# EAGLE board Johnson (EAGLE 8.5.1)
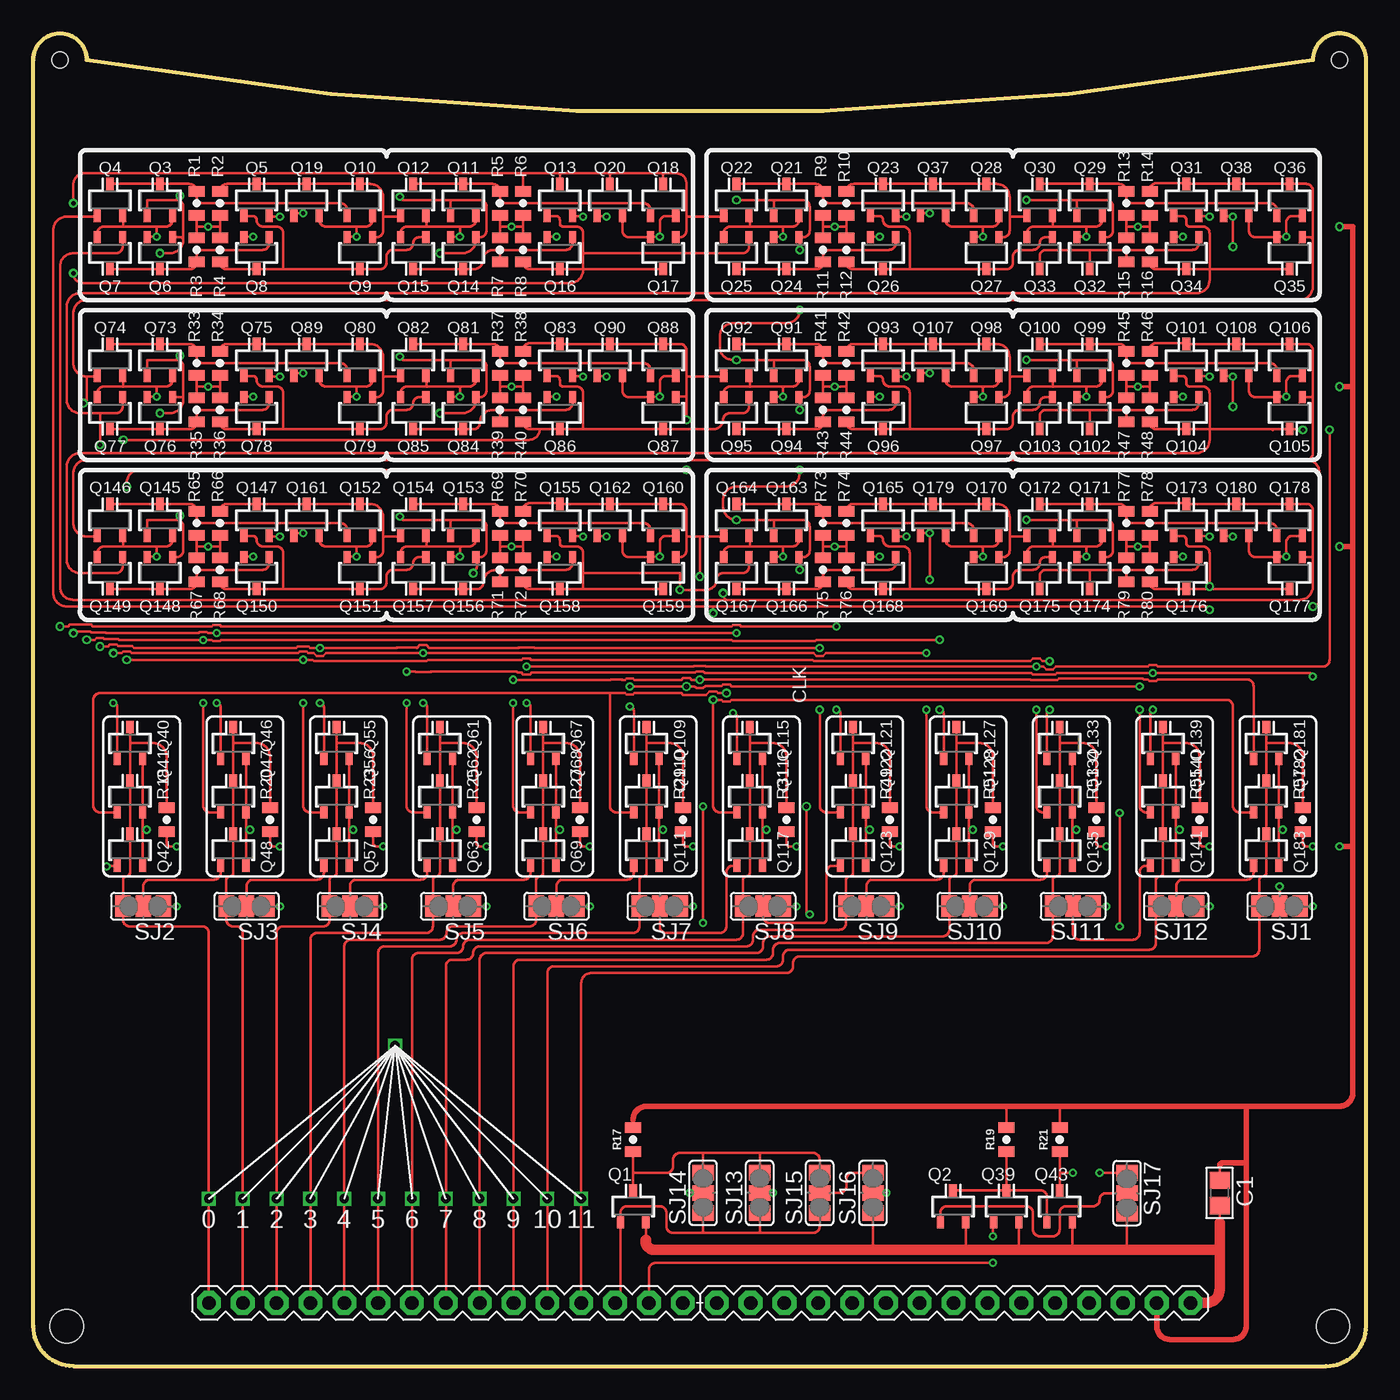
[diagram p5: board, top side]
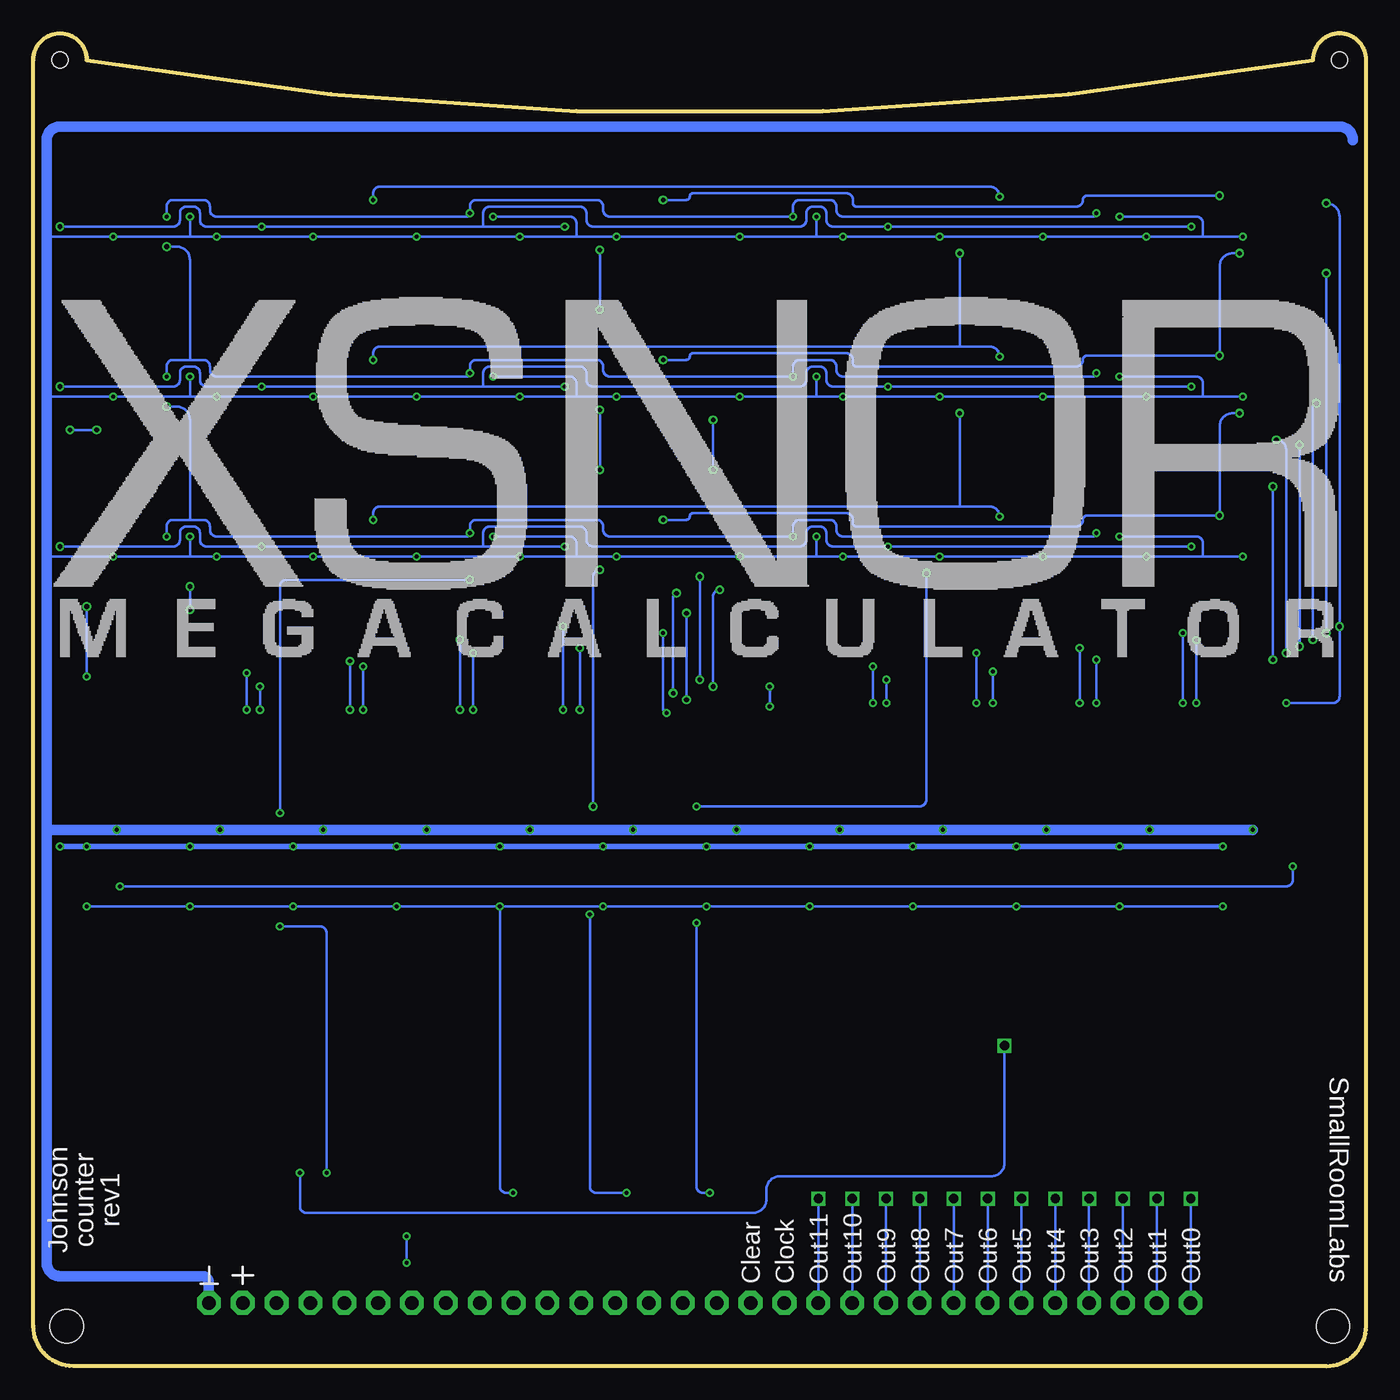
[diagram p6: board, bottom side, seen from below]

Size 100 x 100 mm. Coordinates in mm from the lower left corner, seen from the top.
Outline: 3,0 arc-90 0,3 0,98 arc-90 2,100 arc-90 4,98 arc20 96,98 arc-90 98,100 arc-90 100,98 100,3 arc-90 97,0 3,0
Copper layers (1*16): Top 0.035mm / dielectric 1.5mm / Bottom 0.035mm
Design rules "dirt_cheap_dirty_boards.v1": minimum track width 5mil, minimum drill 12mil, track to track 5mil, track to pad 5mil, pad to pad 5mil, via to via 5mil, smd to smd 0mil, copper to edge 10mil, drill to drill 10mil, minimum pad ring 10mil, minimum via ring 6mil, stop-mask expansion 2mil, vias tented up to drill 25mil, thermal gap 10mil
Net classes: 0 default: width 0.2 mm, drill 0.305 mm, clearance 0.2 mm
Holes 2.5 mm at 2.5,3 97.5,3
Holes 1.2 mm at 2,98 98,98

## Footprints (pad centres in the part's own frame; a part is rotated, then mirrored left to right if it is on the bottom)
C0805 = smd 1.3 x 1.5: 1 -0.95,0; 2 0.95,0
1X30 = drill 1.016 pad 1.778 octagon: 1 -36.83,0; 2 -34.29,0; 3 -31.75,0; 4 -29.21,0; 5 -26.67,0; 6 -24.13,0; 7 -21.59,0; 8 -19.05,0; 9 -16.51,0; 10 -13.97,0; 11 -11.43,0; 12 -8.89,0; 13 -6.35,0; 14 -3.81,0; 15 -1.27,0; 16 1.27,0; 17 3.81,0; 18 6.35,0; 19 8.89,0; 20 11.43,0; 21 13.97,0; 22 16.51,0; 23 19.05,0; 24 21.59,0; 25 24.13,0; 26 26.67,0; 27 29.21,0; 28 31.75,0; 29 34.29,0; 30 36.83,0
SOT23 = smd 0.6 x 0.9: 1 -0.95,-1.2; 2 0.95,-1.2 | smd 0.65 x 0.9: 3 0,1.2
0805 = smd 0.8 x 1.2: 1 -0.9,0; 2 0.9,0
SJ_2 = smd 1.168 x 1.6: 1 -1.524,0; 2 0,0; 3 1.524,0

## Placement (x,y rotation side)
C1  [C0805]  89,13 270 top
JP1  [1X30]  50,4.75 0 top
Q1  310mA/60V/1.6Ω  [SOT23]  45,12 0 top
Q2  310mA/60V/1.6Ω  [SOT23]  69,12 0 top
Q3  310mA/60V/1.6Ω  [SOT23]  9.5,87.5 0 top
Q4  310mA/60V/1.6Ω  [SOT23]  5.75,87.5 0 top
Q5  310mA/60V/1.6Ω  [SOT23]  16.75,87.5 0 top
Q6  310mA/60V/1.6Ω  [SOT23]  9.5,83.5 180 top
Q7  310mA/60V/1.6Ω  [SOT23]  5.75,83.5 180 top
Q8  310mA/60V/1.6Ω  [SOT23]  16.75,83.5 180 top
Q9  310mA/60V/1.6Ω  [SOT23]  24.5,83.5 180 top
Q10  310mA/60V/1.6Ω  [SOT23]  24.5,87.5 0 top
Q11  310mA/60V/1.6Ω  [SOT23]  32.25,87.5 0 top
Q12  310mA/60V/1.6Ω  [SOT23]  28.5,87.5 0 top
Q13  310mA/60V/1.6Ω  [SOT23]  39.5,87.5 0 top
Q14  310mA/60V/1.6Ω  [SOT23]  32.25,83.5 180 top
Q15  310mA/60V/1.6Ω  [SOT23]  28.5,83.5 180 top
Q16  310mA/60V/1.6Ω  [SOT23]  39.5,83.5 180 top
Q17  310mA/60V/1.6Ω  [SOT23]  47.25,83.5 180 top
Q18  310mA/60V/1.6Ω  [SOT23]  47.25,87.5 0 top
Q19  310mA/60V/1.6Ω  [SOT23]  20.5,87.5 0 top
Q20  310mA/60V/1.6Ω  [SOT23]  43.25,87.5 0 top
Q21  310mA/60V/1.6Ω  [SOT23]  56.5,87.5 0 top
Q22  310mA/60V/1.6Ω  [SOT23]  52.75,87.5 0 top
Q23  310mA/60V/1.6Ω  [SOT23]  63.75,87.5 0 top
Q24  310mA/60V/1.6Ω  [SOT23]  56.5,83.5 180 top
Q25  310mA/60V/1.6Ω  [SOT23]  52.75,83.5 180 top
Q26  310mA/60V/1.6Ω  [SOT23]  63.75,83.5 180 top
Q27  310mA/60V/1.6Ω  [SOT23]  71.5,83.5 180 top
Q28  310mA/60V/1.6Ω  [SOT23]  71.5,87.5 0 top
Q29  310mA/60V/1.6Ω  [SOT23]  79.25,87.5 0 top
Q30  310mA/60V/1.6Ω  [SOT23]  75.5,87.5 0 top
Q31  310mA/60V/1.6Ω  [SOT23]  86.5,87.5 0 top
Q32  310mA/60V/1.6Ω  [SOT23]  79.25,83.5 180 top
Q33  310mA/60V/1.6Ω  [SOT23]  75.5,83.5 180 top
Q34  310mA/60V/1.6Ω  [SOT23]  86.5,83.5 180 top
Q35  310mA/60V/1.6Ω  [SOT23]  94.25,83.5 180 top
Q36  310mA/60V/1.6Ω  [SOT23]  94.25,87.5 0 top
Q37  310mA/60V/1.6Ω  [SOT23]  67.5,87.5 0 top
Q38  310mA/60V/1.6Ω  [SOT23]  90.25,87.5 0 top
Q39  310mA/60V/1.6Ω  [SOT23]  73,12 0 top
Q40  310mA/60V/1.6Ω  [SOT23]  7.25,46.75 0 top
Q41  310mA/60V/1.6Ω  [SOT23]  7.25,42.75 0 top
Q42  310mA/60V/1.6Ω  [SOT23]  7.25,38.75 0 top
Q43  310mA/60V/1.6Ω  [SOT23]  77,12 0 top
Q46  310mA/60V/1.6Ω  [SOT23]  15,46.75 0 top
Q47  310mA/60V/1.6Ω  [SOT23]  15,42.75 0 top
Q48  310mA/60V/1.6Ω  [SOT23]  15,38.75 0 top
Q55  310mA/60V/1.6Ω  [SOT23]  22.75,46.75 0 top
Q56  310mA/60V/1.6Ω  [SOT23]  22.75,42.75 0 top
Q57  310mA/60V/1.6Ω  [SOT23]  22.75,38.75 0 top
Q61  310mA/60V/1.6Ω  [SOT23]  30.5,46.75 0 top
Q62  310mA/60V/1.6Ω  [SOT23]  30.5,42.75 0 top
Q63  310mA/60V/1.6Ω  [SOT23]  30.5,38.75 0 top
Q67  310mA/60V/1.6Ω  [SOT23]  38.25,46.75 0 top
Q68  310mA/60V/1.6Ω  [SOT23]  38.25,42.75 0 top
Q69  310mA/60V/1.6Ω  [SOT23]  38.25,38.75 0 top
Q73  310mA/60V/1.6Ω  [SOT23]  9.5,75.5 0 top
Q74  310mA/60V/1.6Ω  [SOT23]  5.75,75.5 0 top
Q75  310mA/60V/1.6Ω  [SOT23]  16.75,75.5 0 top
Q76  310mA/60V/1.6Ω  [SOT23]  9.5,71.5 180 top
Q77  310mA/60V/1.6Ω  [SOT23]  5.75,71.5 180 top
Q78  310mA/60V/1.6Ω  [SOT23]  16.75,71.5 180 top
Q79  310mA/60V/1.6Ω  [SOT23]  24.5,71.5 180 top
Q80  310mA/60V/1.6Ω  [SOT23]  24.5,75.5 0 top
Q81  310mA/60V/1.6Ω  [SOT23]  32.25,75.5 0 top
Q82  310mA/60V/1.6Ω  [SOT23]  28.5,75.5 0 top
Q83  310mA/60V/1.6Ω  [SOT23]  39.5,75.5 0 top
Q84  310mA/60V/1.6Ω  [SOT23]  32.25,71.5 180 top
Q85  310mA/60V/1.6Ω  [SOT23]  28.5,71.5 180 top
Q86  310mA/60V/1.6Ω  [SOT23]  39.5,71.5 180 top
Q87  310mA/60V/1.6Ω  [SOT23]  47.25,71.5 180 top
Q88  310mA/60V/1.6Ω  [SOT23]  47.25,75.5 0 top
Q89  310mA/60V/1.6Ω  [SOT23]  20.5,75.5 0 top
Q90  310mA/60V/1.6Ω  [SOT23]  43.25,75.5 0 top
Q91  310mA/60V/1.6Ω  [SOT23]  56.5,75.5 0 top
Q92  310mA/60V/1.6Ω  [SOT23]  52.75,75.5 0 top
Q93  310mA/60V/1.6Ω  [SOT23]  63.75,75.5 0 top
Q94  310mA/60V/1.6Ω  [SOT23]  56.5,71.5 180 top
Q95  310mA/60V/1.6Ω  [SOT23]  52.75,71.5 180 top
Q96  310mA/60V/1.6Ω  [SOT23]  63.75,71.5 180 top
Q97  310mA/60V/1.6Ω  [SOT23]  71.5,71.5 180 top
Q98  310mA/60V/1.6Ω  [SOT23]  71.5,75.5 0 top
Q99  310mA/60V/1.6Ω  [SOT23]  79.25,75.5 0 top
Q100  310mA/60V/1.6Ω  [SOT23]  75.5,75.5 0 top
Q101  310mA/60V/1.6Ω  [SOT23]  86.5,75.5 0 top
Q102  310mA/60V/1.6Ω  [SOT23]  79.25,71.5 180 top
Q103  310mA/60V/1.6Ω  [SOT23]  75.5,71.5 180 top
Q104  310mA/60V/1.6Ω  [SOT23]  86.5,71.5 180 top
Q105  310mA/60V/1.6Ω  [SOT23]  94.25,71.5 180 top
Q106  310mA/60V/1.6Ω  [SOT23]  94.25,75.5 0 top
Q107  310mA/60V/1.6Ω  [SOT23]  67.5,75.5 0 top
Q108  310mA/60V/1.6Ω  [SOT23]  90.25,75.5 0 top
Q109  310mA/60V/1.6Ω  [SOT23]  46,46.75 0 top
Q110  310mA/60V/1.6Ω  [SOT23]  46,42.75 0 top
Q111  310mA/60V/1.6Ω  [SOT23]  46,38.75 0 top
Q115  310mA/60V/1.6Ω  [SOT23]  53.75,46.75 0 top
Q116  310mA/60V/1.6Ω  [SOT23]  53.75,42.75 0 top
Q117  310mA/60V/1.6Ω  [SOT23]  53.75,38.75 0 top
Q121  310mA/60V/1.6Ω  [SOT23]  61.5,46.75 0 top
Q122  310mA/60V/1.6Ω  [SOT23]  61.5,42.75 0 top
Q123  310mA/60V/1.6Ω  [SOT23]  61.5,38.75 0 top
Q127  310mA/60V/1.6Ω  [SOT23]  69.25,46.75 0 top
Q128  310mA/60V/1.6Ω  [SOT23]  69.25,42.75 0 top
Q129  310mA/60V/1.6Ω  [SOT23]  69.25,38.75 0 top
Q133  310mA/60V/1.6Ω  [SOT23]  77,46.75 0 top
Q134  310mA/60V/1.6Ω  [SOT23]  77,42.75 0 top
Q135  310mA/60V/1.6Ω  [SOT23]  77,38.75 0 top
Q139  310mA/60V/1.6Ω  [SOT23]  84.75,46.75 0 top
Q140  310mA/60V/1.6Ω  [SOT23]  84.75,42.75 0 top
Q141  310mA/60V/1.6Ω  [SOT23]  84.75,38.75 0 top
Q145  310mA/60V/1.6Ω  [SOT23]  9.5,63.5 0 top
Q146  310mA/60V/1.6Ω  [SOT23]  5.75,63.5 0 top
Q147  310mA/60V/1.6Ω  [SOT23]  16.75,63.5 0 top
Q148  310mA/60V/1.6Ω  [SOT23]  9.5,59.5 180 top
Q149  310mA/60V/1.6Ω  [SOT23]  5.75,59.5 180 top
Q150  310mA/60V/1.6Ω  [SOT23]  16.75,59.5 180 top
Q151  310mA/60V/1.6Ω  [SOT23]  24.5,59.5 180 top
Q152  310mA/60V/1.6Ω  [SOT23]  24.5,63.5 0 top
Q153  310mA/60V/1.6Ω  [SOT23]  32.25,63.5 0 top
Q154  310mA/60V/1.6Ω  [SOT23]  28.5,63.5 0 top
Q155  310mA/60V/1.6Ω  [SOT23]  39.5,63.5 0 top
Q156  310mA/60V/1.6Ω  [SOT23]  32.25,59.5 180 top
Q157  310mA/60V/1.6Ω  [SOT23]  28.5,59.5 180 top
Q158  310mA/60V/1.6Ω  [SOT23]  39.5,59.5 180 top
Q159  310mA/60V/1.6Ω  [SOT23]  47.25,59.5 180 top
Q160  310mA/60V/1.6Ω  [SOT23]  47.25,63.5 0 top
Q161  310mA/60V/1.6Ω  [SOT23]  20.5,63.5 0 top
Q162  310mA/60V/1.6Ω  [SOT23]  43.25,63.5 0 top
Q163  310mA/60V/1.6Ω  [SOT23]  56.5,63.5 0 top
Q164  310mA/60V/1.6Ω  [SOT23]  52.75,63.5 0 top
Q165  310mA/60V/1.6Ω  [SOT23]  63.75,63.5 0 top
Q166  310mA/60V/1.6Ω  [SOT23]  56.5,59.5 180 top
Q167  310mA/60V/1.6Ω  [SOT23]  52.75,59.5 180 top
Q168  310mA/60V/1.6Ω  [SOT23]  63.75,59.5 180 top
Q169  310mA/60V/1.6Ω  [SOT23]  71.5,59.5 180 top
Q170  310mA/60V/1.6Ω  [SOT23]  71.5,63.5 0 top
Q171  310mA/60V/1.6Ω  [SOT23]  79.25,63.5 0 top
Q172  310mA/60V/1.6Ω  [SOT23]  75.5,63.5 0 top
Q173  310mA/60V/1.6Ω  [SOT23]  86.5,63.5 0 top
Q174  310mA/60V/1.6Ω  [SOT23]  79.25,59.5 180 top
Q175  310mA/60V/1.6Ω  [SOT23]  75.5,59.5 180 top
Q176  310mA/60V/1.6Ω  [SOT23]  86.5,59.5 180 top
Q177  310mA/60V/1.6Ω  [SOT23]  94.25,59.5 180 top
Q178  310mA/60V/1.6Ω  [SOT23]  94.25,63.5 0 top
Q179  310mA/60V/1.6Ω  [SOT23]  67.5,63.5 0 top
Q180  310mA/60V/1.6Ω  [SOT23]  90.25,63.5 0 top
Q181  310mA/60V/1.6Ω  [SOT23]  92.5,46.75 0 top
Q182  310mA/60V/1.6Ω  [SOT23]  92.5,42.75 0 top
Q183  310mA/60V/1.6Ω  [SOT23]  92.5,38.75 0 top
R1  [0805]  12.25,87.25 270 top
R2  [0805]  14,87.25 270 top
R3  [0805]  12.25,83.75 90 top
R4  [0805]  14,83.75 90 top
R5  [0805]  35,87.25 270 top
R6  [0805]  36.75,87.25 270 top
R7  [0805]  35,83.75 90 top
R8  [0805]  36.75,83.75 90 top
R9  [0805]  59.25,87.25 270 top
R10  [0805]  61,87.25 270 top
R11  [0805]  59.25,83.75 90 top
R12  [0805]  61,83.75 90 top
R13  [0805]  82,87.25 270 top
R14  [0805]  83.75,87.25 270 top
R15  [0805]  82,83.75 90 top
R16  [0805]  83.75,83.75 90 top
R17  [0805]  45,17 90 top
R18  [0805]  10,41 270 top
R19  [0805]  73,17 90 top
R20  [0805]  17.75,41 270 top
R21  [0805]  77,17 90 top
R23  [0805]  25.5,41 270 top
R25  [0805]  33.25,41 270 top
R27  [0805]  41,41 270 top
R29  [0805]  48.75,41 270 top
R31  [0805]  56.5,41 270 top
R33  [0805]  12.25,75.25 270 top
R34  [0805]  14,75.25 270 top
R35  [0805]  12.25,71.75 90 top
R36  [0805]  14,71.75 90 top
R37  [0805]  35,75.25 270 top
R38  [0805]  36.75,75.25 270 top
R39  [0805]  35,71.75 90 top
R40  [0805]  36.75,71.75 90 top
R41  [0805]  59.25,75.25 270 top
R42  [0805]  61,75.25 270 top
R43  [0805]  59.25,71.75 90 top
R44  [0805]  61,71.75 90 top
R45  [0805]  82,75.25 270 top
R46  [0805]  83.75,75.25 270 top
R47  [0805]  82,71.75 90 top
R48  [0805]  83.75,71.75 90 top
R49  [0805]  64.25,41 270 top
R51  [0805]  72,41 270 top
R53  [0805]  79.75,41 270 top
R55  [0805]  87.5,41 270 top
R57  [0805]  95.25,41 270 top
R65  [0805]  12.25,63.25 270 top
R66  [0805]  14,63.25 270 top
R67  [0805]  12.25,59.75 90 top
R68  [0805]  14,59.75 90 top
R69  [0805]  35,63.25 270 top
R70  [0805]  36.75,63.25 270 top
R71  [0805]  35,59.75 90 top
R72  [0805]  36.75,59.75 90 top
R73  [0805]  59.25,63.25 270 top
R74  [0805]  61,63.25 270 top
R75  [0805]  59.25,59.75 90 top
R76  [0805]  61,59.75 90 top
R77  [0805]  82,63.25 270 top
R78  [0805]  83.75,63.25 270 top
R79  [0805]  82,59.75 90 top
R80  [0805]  83.75,59.75 90 top
SJ1  [SJ_2]  93.5,34.5 180 top
SJ2  [SJ_2]  8.25,34.5 180 top
SJ3  [SJ_2]  16,34.5 180 top
SJ4  [SJ_2]  23.75,34.5 180 top
SJ5  [SJ_2]  31.5,34.5 180 top
SJ6  [SJ_2]  39.25,34.5 180 top
SJ7  [SJ_2]  47,34.5 180 top
SJ8  [SJ_2]  54.75,34.5 180 top
SJ9  [SJ_2]  62.5,34.5 180 top
SJ10  [SJ_2]  70.25,34.5 180 top
SJ11  [SJ_2]  78,34.5 180 top
SJ12  [SJ_2]  85.75,34.5 180 top
SJ13  [SJ_2]  54.5,13 90 top
SJ14  [SJ_2]  50.25,13 90 top
SJ15  [SJ_2]  59,13 90 top
SJ16  [SJ_2]  63,13 90 top
SJ17  [SJ_2]  82.05,12.98 270 top

## Tracks (layer width: path | path; a pad name or v marks a point on that pad's centre or on a via)
/CLK  (via drill 0.3, 0.35)
  Top 0.2: 31.3,87.5 Q11.1 | 31.3,87.5 33.5,87.5 arc-90 34,87 34,85.2 arc-90 33.5,84.7 Q14.1 33.2,84.5 arc-90 32.2,83.5 v30.5,83.5 | 78.3,87.5 Q29.1 | 78.3,87.5 v74.5,87.5 | Q32.1 80.5,84.7 arc90 81,85.2 81,87 arc90 80.5,87.5 78.3,87.5 | v27.5,87.75 arc90 27.75,87.5 31.3,87.5 | 31.3,75.5 Q81.1 | 31.3,75.5 33.5,75.5 arc-90 34,75 34,73.2 arc-90 33.5,72.7 Q84.1 33.2,72.5 arc-90 32.2,71.5 v30.5,71.5 | 78.3,75.5 Q99.1 | 78.3,75.5 v74.5,75.5 | Q102.1 80.5,72.7 arc90 81,73.2 81,75 arc90 80.5,75.5 78.3,75.5 | v27.5,75.75 arc90 27.75,75.5 31.3,75.5 | 31.3,63.5 Q153.1 | 31.3,63.5 33.5,63.5 arc-90 34,63 34,61.2 arc-90 33.5,60.7 Q156.1 33.2,60.5 arc-90 32.95,59.5 v33,59.5 | 78.3,63.5 Q171.1 | 78.3,63.5 v74.5,63.5 | Q174.1 80.5,60.7 arc90 81,61.2 81,63 arc90 80.5,63.5 78.3,63.5 | v27.5,63.75 arc90 27.75,63.5 31.3,63.5 | v50.25,42 v50.25,33.25 | v49.25,13 SJ14.2
  Bottom 0.2: v74.5,87.5 74.5,88 arc90 74,88.5 28.25,88.5 arc90 v27.5,87.75 | 30.5,76.5 74,76.5 arc-90 74.5,76 v74.5,75.5 | 30.5,64.5 74,64.5 arc-90 74.5,64 v74.5,63.5 | v30.5,71.5 30.5,64.5 | v30.5,83.5 30.5,76.5 | v27.5,75.75 arc-90 28.25,76.5 30.5,76.5 | v27.5,63.75 arc-90 28.25,64.5 30.5,64.5 | v50.25,33.25 50.25,13.5 arc-90 49.75,13 v49.25,13 | v33,59.5 33,42.5 arc90 33.5,42 v50.25,42
/Q0  (via drill 0.3, 0.35)
  Top 0.2: 41.25,82.3 Q16.3 37.25,82.3 arc-90 36.75,82.8 R8.1 | 41.25,82.3 Q17.3 arc90 47.3,82.25 | 41.25,83.5 41.25,85 arc90 40.75,85.5 39.75,85.5 arc-90 39.5,85.75 39.5,86 arc90 39.2,86.3 Q13.1 | 41.25,83.5 41.25,82.3 | 53.7,84.5 Q25.1 53.7,84 arc-90 53.2,83.5 41.25,83.5 | 41.25,82.3 41.25,82.25 arc-90 40.25,81.25 3.75,81.25 arc-90 v3,82 | v3,55 3.13,55.13 4.26,55.13 4.36,55.03 5.43,55.03 5.45,55 12.4,55 12.5,55.1 13,55.1 13.1,55 v13.75,55 v52.75,55 | Q115.1 52.8,48.7 arc90 v52.5,49 | Q46.1 14.05,49.45 arc90 v13.75,49.75
  Bottom 0.2: v3,82 v3,55 | v52.5,49 52.75,49.25 v52.75,55 | v13.75,49.75 v13.75,55
/Q1  (via drill 0.3, 0.35)
  Top 0.2: 88.25,82.3 Q34.3 84.25,82.3 arc-90 83.75,82.8 R16.1 | 88.25,82.3 Q35.3 arc90 94.3,82.25 | 88.25,82.3 88.25,85 arc90 87.75,85.5 86.75,85.5 arc-90 86.5,85.75 86.5,86 arc90 86.2,86.3 Q31.1 | 6.7,72.5 Q77.1 6.7,72 arc-90 6.2,71.5 5,71.5 | 88.25,82.3 88.25,81.5 arc-90 87.25,80.5 3.5,80.5 arc90 2.5,79.5 2.5,72.5 arc90 3.5,71.5 5,71.5 | 5,71.5 v5,69.13 | v5,54 5.61,54 5.74,54.13 6.26,54.13 6.36,54.03 7.43,54.03 7.56,53.89 19.72,53.89 19.83,54.01 20.67,54.01 20.78,53.9 v21.5,53.9 27.24,53.9 27.25,53.91 28.75,53.91 28.76,53.9 28.8,53.9 29,54.1 29.5,54.1 29.7,53.9 36.41,53.9 36.42,53.91 37.58,53.91 37.59,53.9 v59,53.9 | Q122.1 59.5,41.55 arc-90 59,42.05 v59,49.25 | Q55.1 21.8,49.45 arc90 v21.5,49.75
  Bottom 0.2: v5,69.13 v5,54 | v59,49.25 v59,53.9 | v21.5,49.75 v21.5,53.9
/Q2  (via drill 0.3, 0.35)
  Top 0.2: 41.25,70.3 Q86.3 38,70.3 | Q87.3 41.25,70.3 | 41.25,70.3 41.25,73 arc90 40.75,73.5 39.75,73.5 arc-90 39.5,73.75 39.5,74 arc90 39.2,74.3 Q83.1 | 38,70.3 37.25,70.3 arc-90 36.75,70.8 R40.1 | Q87.3 arc90 47.3,70.25 | 53.7,72.5 Q95.1 53.7,72 arc-90 53.2,71.5 52.25,71.5 arc90 51.75,71 arc-90 51.05,70.3 Q87.3 | 38,70.3 arc-90 37.2,69.5 v6.75,69.5 | v6,53.5 6.61,53.5 6.74,53.63 7.26,53.63 7.4,53.49 19.89,53.49 20,53.6 20.5,53.6 20.61,53.49 21.05,53.49 21.25,53.29 21.75,53.29 21.95,53.49 27.4,53.49 27.42,53.51 28.58,53.51 28.6,53.49 v29.25,53.49 36.57,53.49 36.58,53.51 37.42,53.51 37.43,53.49 58.55,53.49 58.75,53.29 59.25,53.29 59.45,53.49 v67,53.49 | v29.25,49.75 29.25,49.73 arc-90 29.55,49.44 Q61.1 | Q128.1 67.5,41.55 arc-90 67,42.05 v67,49.25
  Bottom 0.2: v6.75,69.5 arc90 6,68.75 v6,53.5 | v67,49.25 v67,53.49 | v29.25,49.75 v29.25,53.49
/Q3  (via drill 0.3, 0.35)
  Top 0.2: 88.25,70.3 Q104.3 84.25,70.3 arc-90 83.75,70.8 R48.1 | Q105.3 93,70.3 | 93,70.3 88.25,70.3 | 88.25,70.3 88.25,73 arc90 87.75,73.5 86.75,73.5 arc-90 86.5,73.75 86.5,74 arc90 86.2,74.3 Q101.1 | Q105.3 arc90 94.3,70.25 | 88.25,70.3 88.25,69.5 arc-90 87.25,68.5 3.5,68.5 arc90 2.5,67.5 2.5,60.5 arc90 3.5,59.5 6.2,59.5 arc90 6.7,60 Q149.1 | 93,70.3 93,70.25 | v95.25,70.25 arc90 95.2,70.3 Q105.3 | v37,52.5 49.55,52.5 49.57,52.53 50.43,52.53 50.46,52.49 v75.25,52.49 75.8,52.49 76,52.29 76.5,52.29 76.7,52.49 83.64,52.49 83.75,52.6 84.25,52.6 84.36,52.49 96.75,52.49 arc90 97.25,52.99 v97.25,70.25 | Q67.1 37.3,49.45 arc90 v37,49.75 | Q134.1 75.75,41.55 arc-90 75.25,42.05 v75.25,49.25
  Bottom 0.2: v95.25,70.25 v97.25,70.25 | v75.25,49.25 v75.25,52.49 | v37,49.75 v37,52.5
/Q4  (via drill 0.3, 0.35)
  Top 0.2: 41.25,58.3 Q158.3 37.25,58.3 arc-90 36.75,58.8 R72.1 | 41.25,58.3 Q159.3 arc90 47.3,58.25 | 41.25,59.5 41.25,61 arc90 40.75,61.5 39.75,61.5 arc-90 39.5,61.75 39.5,62 arc90 39.2,62.3 Q155.1 | 41.25,59.5 41.25,58.3 | 53.7,60.5 Q167.1 53.7,60 arc-90 53.2,59.5 51.75,59.5 arc90 51.25,59 arc-90 50.5,58.25 v48.5,58.25 48.5,59.5 41.25,59.5 | v44.75,51 v49,51 49.61,51 49.74,50.87 50.26,50.87 50.41,51.03 51.64,51.03 51.74,51.13 52.26,51.13 52.39,51 v83,51 | Q109.1 45.05,49.2 arc90 v44.75,49.5 | Q140.1 83.5,41.55 arc-90 83,42.05 v83,49.25
  Bottom 0.2: v49,51 49,57.75 arc90 v48.5,58.25 | v83,49.25 v83,51 | v44.75,49.5 v44.75,51
/Q5  (via drill 0.35)
  Top 0.2: 52.72,41.55 Q116.1 51.5,41.55 arc-90 51,42.05 v51,50 51.61,50 51.74,49.87 52.26,49.87 52.39,50 82.58,50 82.58,49.99 83.42,49.99 83.42,50 89.5,50 arc-90 90,49.5 90,42.05 arc90 90.5,41.55 Q182.1 | 88.25,58.3 Q176.3 84.25,58.3 arc-90 83.75,58.8 R80.1 | 88.25,58.3 Q177.3 arc90 94.3,58.25 | 88.25,58.3 v88.25,58.5 88.25,61 arc90 87.75,61.5 86.75,61.5 arc-90 86.5,61.75 86.5,62 arc90 86.2,62.3 Q173.1 | Q4.1 arc-90 4.75,86.25 2.5,86.25 arc90 1.5,85.25 1.5,58 arc90 2.5,57 51,57 | 51,57 88,57 arc-90 v88.25,56.75 | 51,57 v51,56.5
  Bottom 0.2: v88.25,56.75 arc90 88.25,57 v88.25,58.5 | v51,56.5 v51,50
C0  (via drill 0.3)
  Top 0.2: SJ1.2 v93.5,36 | v5.5,37.5 arc-90 5.55,37.55 Q42.1
  Bottom 0.2: v93.5,36 6,36 arc-90 5.5,36.5 v5.5,37.5
C1
  Top 0.2: SJ2.2 8.25,36 arc-90 8.75,36.5 13.55,36.5 arc90 14.05,37 Q48.1
C2
  Top 0.2: SJ3.2 16,36 arc-90 16.5,36.5 21.3,36.5 arc90 21.8,37 Q57.1
C3
  Top 0.2: SJ4.2 23.75,36 arc-90 24.25,36.5 29.05,36.5 arc90 29.55,37 Q63.1
C4
  Top 0.2: SJ5.2 31.5,36 arc-90 32,36.5 36.8,36.5 arc90 37.3,37 Q69.1
C5
  Top 0.2: SJ6.2 39.25,36 arc-90 39.75,36.5 44.55,36.5 arc90 45.05,37 Q111.1
C6
  Top 0.2: SJ7.2 47,33 arc90 47.5,32.5 51.5,32.5 arc90 52,33 52,37.05 arc-90 52.5,37.55 Q117.1
C7
  Top 0.2: SJ8.2 54.75,33.75 arc90 55.25,33.25 59.25,33.25 arc90 59.5,33.5 59.5,37.05 arc-90 60,37.55 Q123.1
C8
  Top 0.2: SJ9.2 62.5,36 arc-90 63,36.5 67.8,36.5 arc90 68.3,37 Q129.1
C9
  Top 0.2: SJ10.2 70.25,36 arc-90 70.75,36.5 75.55,36.5 arc90 76.05,37 Q135.1
C10
  Top 0.2: Q141.1 83.5,37.55 arc90 83,37.05 83,32.5 arc-90 82.5,32 78.5,32 arc-90 78,32.5 SJ11.2
C11
  Top 0.2: SJ12.2 85.75,36 arc-90 86.25,36.5 91.05,36.5 arc90 91.55,37 Q183.1
CLK  (via drill 0.3, 0.35)
  Top 0.2: Q3.1 8.55,87.5 10.68,87.5 | 10.75,84.7 Q6.1 11.05,84.7 arc-90 11.25,84.5 | 55.55,87.5 Q21.1 | 55.55,87.5 57.75,87.5 arc-90 58.25,87 58.25,85.2 arc-90 57.75,84.7 Q24.1 arc-90 57.5,84.65 v57.5,83.75 | 10.68,87.5 10.75,87.5 arc-90 11.25,87 11.25,85.2 11.25,84.5 | 10.68,87.5 arc90 v11,87.82 | 55.55,87.5 v52.75,87.5 | Q73.1 8.55,75.5 10.68,75.5 | 55.55,75.5 Q91.1 | 55.55,75.5 57.75,75.5 arc-90 58.25,75 58.25,73.2 arc-90 57.75,72.7 Q94.1 arc-90 57.5,72.65 v57.5,71.75 | 10.68,75.5 10.75,75.5 arc-90 11.25,75 11.25,73.2 11.25,72.75 | 10.68,75.5 arc90 v11,75.82 | 55.55,75.5 v52.75,75.5 52.5,75.5 arc-90 51.5,76.5 51.5,77.25 arc-90 52.5,78.25 56.5,78.25 arc90 v57.5,79.25 | Q145.1 8.55,63.5 10.68,63.5 | Q148.1 10.75,60.7 arc90 11.25,61.2 11.25,63 arc90 10.75,63.5 10.68,63.5 | 55.55,63.5 Q163.1 | 55.55,63.5 57.75,63.5 arc-90 58.25,63 58.25,61.2 arc-90 57.75,60.7 Q166.1 arc-90 57.5,60.65 v57.5,59.75 | 10.68,63.5 arc90 v11,63.82 | 55.55,63.5 v52.75,63.5 arc-90 51.75,64.5 51.75,65 arc-90 52.75,66 56.5,66 arc90 57.5,67 v57.5,67.25 | v9.5,71.5 10.25,71.5 arc90 11.25,72.5 11.25,72.75 | Q76.1 11.2,72.7 arc90 11.25,72.75 | v9.5,83.5 10.25,83.5 arc90 11.25,84.5 | v58,42 58,34.14 arc90 v58.25,33.89 | v55.5,13 SJ13.2
  Bottom 0.2: v11,87.82 20.93,87.82 arc-90 21.25,87.5 arc90 21.75,87 38.25,87 arc90 38.5,87.25 38.5,87.5 arc-90 39,88 50.5,88 arc-90 50.75,87.75 arc90 51,87.5 v52.75,87.5 | v52.75,75.5 51,75.5 arc-90 50.75,75.75 arc90 50.5,76 39,76 arc90 38.5,75.5 38.5,75.25 arc-90 38.25,75 21.75,75 arc-90 21.25,75.5 arc90 20.93,75.82 v11,75.82 11,82.5 arc90 10,83.5 v9.5,83.5 | v52.75,63.5 51,63.5 arc-90 50.75,63.75 arc90 50.5,64 39,64 arc90 38.5,63.5 38.5,63.25 arc-90 38.25,63 21.75,63 arc-90 21.25,63.5 arc90 20.93,63.82 v11,63.82 11,70.5 arc90 10,71.5 v9.5,71.5 | v57.5,67.25 v57.5,71.75 | v57.5,79.25 v57.5,83.75 | v58.25,33.89 58.25,13.5 arc-90 57.75,13 v55.5,13 | v58,42 58,59.25 arc90 v57.5,59.75
CLKIN
  Top 0.2: JP1.13 43.9,5 arc45 44.05,5.36 Q1.1 44.05,11.5 arc-90 44.55,12 47,12 arc-90 47.5,11.5 47.5,10.5 arc90 48,10 50.25,10 | SJ15.1 59,10.5 arc-90 58.5,10 55,10 54.5,10 | 54.5,10 51,10 50.25,10 | SJ14.1 50.25,10 | SJ13.1 54.5,10
CLR  (via drill 0.3, 0.35)
  Top 0.2: Q20.1 42.95,86.3 arc-90 v43,86.25 | v20.25,86.5 19.75,86.5 arc90 Q19.1 | Q38.1 89.95,86.3 arc-90 v90,86.25 v90,84 | v67.25,86.5 66.75,86.5 arc90 Q37.1 | Q90.1 42.95,74.3 arc-90 v43,74.25 | v20.25,74.5 19.75,74.5 arc90 Q89.1 | Q108.1 89.95,74.3 arc-90 v90,74.25 v90,72 | v67.25,74.5 66.75,74.5 arc90 Q107.1 | Q162.1 42.95,62.3 arc-90 v43,62.25 | v20.25,62.5 19.75,62.5 arc90 Q161.1 | Q180.1 89.95,62.3 arc-90 v90,62.25 | Q179.1 arc-90 66.75,62.5 v67.25,62.5 v67.25,59 | Q43.3 77,14.5 | 77,14.5 R21.1 | v81.5,41.5 v81.5,33 | v78,14.5 77,14.5
  Bottom 0.2: v20.25,86.5 arc90 20.5,86.25 39.25,86.25 arc90 39.75,86.75 39.75,87 arc-90 40.25,87.5 42.5,87.5 arc-90 43,87 v43,86.25 56.75,86.25 arc90 57.25,86.75 57.25,87 arc-90 57.75,87.5 66.75,87.5 arc-90 67.25,87 v67.25,86.5 arc90 67.5,86.25 86.25,86.25 arc90 86.75,86.75 86.75,87 arc-90 87.25,87.5 89.5,87.5 arc-90 90,87 v90,86.25 | v20.25,74.5 arc90 20.5,74.25 39.25,74.25 arc90 39.75,74.75 39.75,75 arc-90 40.25,75.5 42.5,75.5 arc-90 43,75 v43,74.25 56.75,74.25 arc90 57.25,74.75 57.25,75 arc-90 57.75,75.5 66.75,75.5 arc-90 67.25,75 v67.25,74.5 arc90 67.5,74.25 86.25,74.25 arc90 86.75,74.75 86.75,75 arc-90 87.25,75.5 88.25,75.5 | v90,74.25 90,75 arc90 89.5,75.5 88.25,75.5 | v20.25,62.5 arc90 20.5,62.25 39.25,62.25 arc90 39.75,62.75 39.75,63 arc-90 40.25,63.5 42.5,63.5 arc-90 43,63 v43,62.25 56.75,62.25 arc90 57.25,62.75 57.25,63 arc-90 57.75,63.5 66.75,63.5 arc-90 67.25,63 v67.25,62.5 arc90 67.5,62.25 75.5,62.25 86.25,62.25 arc90 86.75,62.75 86.75,63 arc-90 87.25,63.5 88.25,63.5 | v90,62.25 90,63 arc90 89.5,63.5 88.25,63.5 | 88.25,63.5 88.25,71 arc-90 89.25,72 v90,72 | 88.25,75.5 88.25,83 arc-90 89.25,84 v90,84 | v67.25,59 81,59 arc-90 81.5,58.5 v81.5,41.5 | v81.5,33 78.5,33 arc90 78,32.5 v78,14.5
CLRIN  (via drill 0.3)
  Top 0.2: JP1.14 46.19,7.25 arc-90 46.69,7.75 v72,7.75 | v72,9.75 72,10.75 arc-90 Q39.1
  Bottom 0.2: v72,7.75 v72,9.75
EARLYCLR  (via drill 0.3, 0.7)
  Top 0.2: v80,14.5 arc-90 v80.01,14.51 SJ17.1
  Bottom 0.2: v80,14.5 80,12 arc-90 79.5,11.5 46,11.5 arc-90 45,12.5 45,13.25 arc90 44,14.25 28.13,14.25 arc-90 27.13,15.25 v27.13,24.04
GND  (via drill 0.3)
  Top 0.2: 9.25,85.5 6.75,85.5 | Q4.2 6.75,86.25 6.75,85.5 | 17.75,86.25 Q5.2 arc90 17.75,86.25 | Q6.2 8.6,84.75 v9.25,84.75 9.25,85.5 | Q8.2 15.85,84.75 v16.5,84.75 | Q9.2 23.6,84.75 v24.25,84.75 24.25,85.5 | 32,85.5 29.5,85.5 | 31.25,84.75 Q14.2 31.35,84.75 v32,84.75 32,85.5 | Q12.2 29.5,86.25 29.5,85.5 | 40.5,86.25 Q13.2 41.2,86.3 arc-90 v41.25,86.25 | Q16.2 38.6,84.75 v39.25,84.75 | Q19.2 21.45,86 arc90 21.95,85.5 24.25,85.5 | 24.25,85.5 24.95,85.5 arc90 25.45,86 Q10.2 | 17.75,86.25 v18.5,86.25 | Q7.2 4.8,85 arc-90 5.3,85.5 6.75,85.5 | Q3.2 10.45,86 arc-90 9.95,85.5 9.25,85.5 | Q11.2 33.2,86 arc-90 32.7,85.5 32,85.5 | Q15.2 27.55,85 arc-90 28.05,85.5 29.5,85.5 | Q20.2 44.2,85.2 arc90 44.7,84.7 Q17.2 46.35,84.75 v47,84.75 47,85.8 arc-90 47.5,86.3 Q18.2 | 56.25,85.5 53.75,85.5 | Q22.2 53.75,86.25 53.75,85.5 | 64.75,86.25 Q23.2 arc90 64.75,86.25 | 55.6,84.75 Q24.2 arc-90 55.6,84.75 | Q26.2 62.85,84.75 v63.5,84.75 | Q27.2 70.6,84.75 v71.25,84.75 71.25,85.5 | 79,85.5 76.5,85.5 | 78.25,84.75 Q32.2 78.35,84.75 v79,84.75 79,85.5 | Q30.2 76.5,86.25 76.5,85.5 | 87.5,86.25 Q31.2 88.2,86.3 arc-90 v88.25,86.25 | Q34.2 85.6,84.75 v86.25,84.75 | Q37.2 68.45,86 arc90 68.95,85.5 71.25,85.5 | 71.25,85.5 71.95,85.5 arc90 72.45,86 Q28.2 | 64.75,86.25 v65.5,86.25 | Q25.2 51.8,85 arc-90 52.3,85.5 53.75,85.5 | Q21.2 57.45,86 arc-90 56.95,85.5 56.25,85.5 | Q29.2 80.2,86 arc-90 79.7,85.5 79,85.5 | Q33.2 74.55,85 arc-90 75.05,85.5 76.5,85.5 | Q38.2 91.2,85.2 arc90 91.7,84.7 Q35.2 93.35,84.75 v94,84.75 94,85.8 arc-90 94.5,86.3 Q36.2 | 55.6,84.75 v56.25,84.75 56.25,85.5 | 9.25,73.5 6.75,73.5 | Q74.2 6.75,74.25 6.75,73.5 | 17.75,74.25 Q75.2 arc90 17.75,74.25
  Top 0.2: Q76.2 8.6,72.75 v9.25,72.75 9.25,73.5 | Q78.2 15.85,72.75 v16.5,72.75 | Q79.2 23.6,72.75 v24.25,72.75 24.25,73.5 | 32,73.5 29.5,73.5 | 31.25,72.75 Q84.2 31.35,72.75 v32,72.75 32,73.5 | Q82.2 29.5,74.25 29.5,73.5 | 40.5,74.25 Q83.2 41.2,74.3 arc-90 v41.25,74.25 | Q86.2 38.6,72.75 v39.25,72.75 | Q89.2 21.45,74 arc90 21.95,73.5 24.25,73.5 | 24.25,73.5 24.95,73.5 arc90 25.45,74 Q80.2 | 17.75,74.25 v18.5,74.25 | Q77.2 4.8,73 arc-90 5.3,73.5 6.75,73.5 | Q73.2 10.45,74 arc-90 9.95,73.5 9.25,73.5 | Q81.2 33.2,74 arc-90 32.7,73.5 32,73.5 | Q85.2 27.55,73 arc-90 28.05,73.5 29.5,73.5 | Q90.2 44.2,73.2 arc90 44.7,72.7 Q87.2 46.35,72.75 v47,72.75 47,73.8 arc-90 47.5,74.3 Q88.2 | 56.25,73.5 53.75,73.5 | Q92.2 53.75,74.25 53.75,73.5 | 64.75,74.25 Q93.2 arc90 64.75,74.25 | 55.6,72.75 Q94.2 arc-90 55.6,72.75 | Q96.2 62.85,72.75 v63.5,72.75 | Q97.2 70.6,72.75 v71.25,72.75 71.25,73.5 | 79,73.5 76.5,73.5 | 78.25,72.75 Q102.2 78.35,72.75 v79,72.75 79,73.5 | Q100.2 76.5,74.25 76.5,73.5 | 87.5,74.25 Q101.2 88.2,74.3 arc-90 v88.25,74.25 | Q104.2 85.6,72.75 v86.25,72.75 | Q107.2 68.45,74 arc90 68.95,73.5 71.25,73.5 | 71.25,73.5 71.95,73.5 arc90 72.45,74 Q98.2 | 64.75,74.25 v65.5,74.25 | Q95.2 51.8,73 arc-90 52.3,73.5 53.75,73.5 | Q91.2 57.45,74 arc-90 56.95,73.5 56.25,73.5 | Q99.2 80.2,74 arc-90 79.7,73.5 79,73.5 | Q103.2 74.55,73 arc-90 75.05,73.5 76.5,73.5 | Q108.2 91.2,73.2 arc90 91.7,72.7 Q105.2 93.35,72.75 v94,72.75 94,73.8 arc-90 94.5,74.3 Q106.2 | 55.6,72.75 v56.25,72.75 56.25,73.5 | 9.25,61.5 6.75,61.5 | Q146.2 6.75,62.25 6.75,61.5 | 17.75,62.25 Q147.2 arc90 17.75,62.25 | Q148.2 8.6,60.75 v9.25,60.75 9.25,61.5
  Top 0.2: Q150.2 15.85,60.75 v16.5,60.75 | Q151.2 23.6,60.75 v24.25,60.75 24.25,61.5 | 32,61.5 29.5,61.5 | 31.25,60.75 Q156.2 31.35,60.75 v32,60.75 32,61.5 | Q154.2 29.5,62.25 29.5,61.5 | 40.5,62.25 Q155.2 41.2,62.3 arc-90 v41.25,62.25 | Q158.2 38.6,60.75 v39.25,60.75 | Q161.2 21.45,62 arc90 21.95,61.5 24.25,61.5 | 24.25,61.5 24.95,61.5 arc90 25.45,62 Q152.2 | 17.75,62.25 v18.5,62.25 | Q149.2 4.8,61 arc-90 5.3,61.5 6.75,61.5 | Q145.2 10.45,62 arc-90 9.95,61.5 9.25,61.5 | Q153.2 33.2,62 arc-90 32.7,61.5 32,61.5 | Q157.2 27.55,61 arc-90 28.05,61.5 29.5,61.5 | Q162.2 44.2,61.2 arc90 44.7,60.7 Q159.2 46.35,60.75 v47,60.75 47,61.8 arc-90 47.5,62.3 Q160.2 | 56.25,61.5 53.75,61.5 | Q164.2 53.75,62.25 53.75,61.5 | 64.75,62.25 Q165.2 arc90 64.75,62.25 | 55.6,60.75 Q166.2 arc-90 55.6,60.75 | Q168.2 62.85,60.75 v63.5,60.75 | Q169.2 70.6,60.75 v71.25,60.75 71.25,61.5 | 79,61.5 76.5,61.5 | 78.25,60.75 Q174.2 78.35,60.75 v79,60.75 79,61.5 | Q172.2 76.5,62.25 76.5,61.5 | 87.5,62.25 Q173.2 88.2,62.3 arc-90 v88.25,62.25 | Q176.2 85.6,60.75 v86.25,60.75 | Q179.2 68.45,62 arc90 68.95,61.5 71.25,61.5 | 71.25,61.5 71.95,61.5 arc90 72.45,62 Q170.2 | 64.75,62.25 v65.5,62.25 | Q167.2 51.8,61 arc-90 52.3,61.5 53.75,61.5 | Q163.2 57.45,62 arc-90 56.95,61.5 56.25,61.5 | Q171.2 80.2,62 arc-90 79.7,61.5 79,61.5 | Q175.2 74.55,61 arc-90 75.05,61.5 76.5,61.5 | Q180.2 91.2,61.2 arc90 91.7,60.7 Q177.2 93.35,60.75 v94,60.75 94,61.8 arc-90 94.5,62.3 Q178.2 | 55.6,60.75 v56.25,60.75 56.25,61.5 | Q40.2 Q41.2 8.2,40.25 | 8.2,40.25 Q42.2 | v8.5,40.25 8.2,40.25 | Q46.2 Q47.2 15.95,40.25 | 15.95,40.25 Q48.2 | v16.25,40.25 15.95,40.25 | Q55.2 Q56.2 23.7,40.25
  Top 0.2: 23.7,40.25 Q57.2 | v24,40.25 23.7,40.25 | Q61.2 Q62.2 31.45,40.25 | 31.45,40.25 Q63.2 | v31.75,40.25 31.45,40.25 | Q67.2 Q68.2 39.2,40.25 | 39.2,40.25 Q69.2 | v39.5,40.25 39.2,40.25 | Q109.2 Q110.2 46.95,40.25 | 46.95,40.25 Q111.2 | v47.25,40.25 46.95,40.25 | Q115.2 Q116.2 54.7,40.25 | 54.7,40.25 Q117.2 | v55,40.25 54.7,40.25 | Q121.2 Q122.2 62.45,40.25 | 62.45,40.25 Q123.2 | v62.75,40.25 62.45,40.25 | Q127.2 Q128.2 70.2,40.25 | 70.2,40.25 Q129.2 | v70.5,40.25 70.2,40.25 | Q133.2 Q134.2 77.95,40.25 | 77.95,40.25 Q135.2 | v78.25,40.25 77.95,40.25 | Q139.2 Q140.2 85.7,40.25 | 85.7,40.25 Q141.2 | v86,40.25 85.7,40.25 | Q181.2 Q182.2 93.45,40.25 | 93.45,40.25 Q183.2 | v93.75,40.25 93.45,40.25 | Q1.2 45.95,9.5 | SJ17.3 82.05,9.05 arc-90 82,8.75 | Q43.2 77.95,9.05 arc90 78,8.75 | Q2.2 69.95,9.05 arc90 70,8.75 | Q39.2 73.95,9.05 arc90 74,8.75 | SJ16.1 63,8.75 | 89,10.75 C1.2
  Top 0.8: 45.95,9.5 arc90 46.45,8.75 63,8.75 70,8.75 74,8.75 78,8.75 82,8.75 89,8.75 | JP1.30 88,4.75 arc90 89,5.75 89,8.75 | 89,8.75 89,10.75
  Bottom 0.2: 12.25,84.75 v16.5,84.75 v24.25,84.75 v32,84.75 v39.25,84.75 41.25,84.75 | 12.25,84.75 v9.25,84.75 | v18.5,86.25 12.75,86.25 arc90 12.25,85.75 12.25,84.75 | v88.25,86.25 88.25,84.75 | v65.5,86.25 59.75,86.25 arc90 59.25,85.75 59.25,84.75 | v86.25,84.75 v79,84.75 v71.25,84.75 v63.5,84.75 59.25,84.75 | 59.25,84.75 v56.25,84.75 v47,84.75 41.25,84.75 | v41.25,86.25 41.25,84.75 | 12.25,72.75 v16.5,72.75 v24.25,72.75 v32,72.75 v39.25,72.75 41.25,72.75 | 12.25,72.75 v9.25,72.75 | v18.5,74.25 12.75,74.25 arc90 12.25,73.75 12.25,72.75 | v88.25,74.25 88.25,72.75 | v65.5,74.25 59.75,74.25 arc90 59.25,73.75 59.25,72.75 | v86.25,72.75 v79,72.75 v71.25,72.75 v63.5,72.75 59.25,72.75 | 59.25,72.75 v56.25,72.75 v47,72.75 41.25,72.75 | v41.25,74.25 41.25,72.75 | 12.25,60.75 v16.5,60.75 v24.25,60.75 v32,60.75 v39.25,60.75 41.25,60.75 | 12.25,60.75 v9.25,60.75 | v18.5,62.25 12.75,62.25 arc90 12.25,61.75 12.25,60.75 | v88.25,62.25 88.25,60.75 | v65.5,62.25 59.75,62.25 arc90 59.25,61.75 59.25,60.75 | v86.25,60.75 v79,60.75 v71.25,60.75 v63.5,60.75 59.25,60.75 | 59.25,60.75 v56.25,60.75 v47,60.75 41.25,60.75 | v41.25,62.25 41.25,60.75 | v94,84.75 99,84.75 | v94,72.75 99,72.75 | v94,60.75 99,60.75
  Bottom 0.203: v86.25,84.75 88.25,84.75 v94,84.75 | v86.25,72.75 88.25,72.75 v94,72.75 | v86.25,60.75 88.25,60.75 v94,60.75
  Bottom 0.8: 99,40.25 99,7.75 arc-90 98,6.75 87.33,6.75 arc90 86.83,6.25 JP1.30 | 99,40.25 99,60.75 99,72.75 99,84.75 99,92 arc90 98,93 2,93 arc90 1,92 | 99,40.25 v93.75,40.25 v86,40.25 v78.25,40.25 v70.5,40.25 v62.75,40.25 v55,40.25 v47.25,40.25 v39.5,40.25 v31.75,40.25 v24,40.25 v16.25,40.25 v8.5,40.25
N$1  (via drill 0.3)
  Top 0.2: SJ2.1 v10.75,34.5 | v18.5,34.5 SJ3.1 | v26.25,34.5 SJ4.1 | v34,34.5 SJ5.1 | v41.75,34.5 SJ6.1 | v49.5,34.5 SJ7.1 | v57.25,34.5 SJ8.1 | v65,34.5 SJ9.1 | v72.75,34.5 SJ10.1 | v80.5,34.5 SJ11.1 | v88.25,34.5 SJ12.1 | v96,34.5 SJ1.1 | SJ16.2 v64,13
  Bottom 0.2: v10.75,34.5 v18.5,34.5 v26.25,34.5 v34,34.5 v41.75,34.5 v49.5,34.5 v57.25,34.5 64.75,34.5 | 64.75,34.5 v65,34.5 | v65,34.5 v72.75,34.5 v80.5,34.5 v88.25,34.5 v96,34.5 | 65,34.25 arc90 64.75,34.5 | v64,13 64.5,13 arc90 65,13.5 v65,34.5
N$2
  Top 0.2: Q4.3 Q3.3 11.7,88.7 arc-90 R1.1 12.25,87.75 arc90 12.75,87.25 23.05,87.25 arc-90 23.55,86.75 Q10.1
N$3
  Top 0.2: SJ15.2 60.5,13 arc90 61,13.5 61,14.02 arc-90 61.5,14.52 SJ16.3
N$4
  Top 0.2: Q7.3 Q6.3 11.75,82.3 arc90 12.25,82.8 R3.1 12.25,83.25 arc-90 12.75,83.75 17.2,83.75 arc90 17.7,84.25 Q8.1
N$5
  Top 0.2: Q1.3 45,14.5 | 45,14.5 R17.1 | SJ15.3 59,15.5 arc90 58.5,16 55,16 54.5,16 | 45,14.5 47.5,14.5 arc90 48,15 48,15.5 arc-90 48.5,16 50.25,16 | 54.5,16 51,16 50.25,16 | SJ13.3 54.5,16 | SJ14.3 50.25,16
N$6
  Top 0.2: Q39.3 Q2.3 | Q43.1 76.05,12.7 arc90 75.55,13.2 Q39.3 | Q39.3 R19.1
N$7
  Top 0.2: Q12.3 Q11.3 34.45,88.7 arc-90 R5.1 35,87.75 arc90 35.5,87.25 45.8,87.25 arc-90 46.3,86.75 Q18.1
N$8
  Top 0.2: Q16.1 40.45,84.25 arc-90 39.95,83.75 35,83.75 | 35,83.75 34.5,83.75 arc90 33.75,83 arc-90 33.05,82.3 32.5,82.3 | 32.5,82.3 Q14.3 | 32.5,82.3 Q15.3 | 35,83.75 R7.1
N$9
  Top 0.2: R2.1 arc-90 14.55,88.7 Q5.3 Q19.3 Q10.3 25.25,88.7 arc-90 26.25,87.7 26.25,86.25 | Q9.1 25.75,84.7 arc90 26.25,85.2 26.25,86.25 | Q12.1 arc-90 27.5,86.25 26.25,86.25
N$10
  Top 0.2: 18.75,82.3 Q9.3 26,82.3 arc90 26.5,82.8 26.5,83.25 arc-90 27,83.75 28,83.75 arc90 28.5,84.25 arc-90 28.95,84.7 Q15.1 | 18.75,82.3 Q8.3 14.5,82.3 arc-90 14,82.8 R4.1 | Q5.1 16.45,86.3 arc-90 16.75,86 arc90 17.25,85.5 18.25,85.5 arc-90 18.75,85 18.75,82.3
N$11
  Top 0.2: Q22.3 Q21.3 58.7,88.7 arc-90 R9.1 59.25,87.75 arc90 59.75,87.25 70.05,87.25 arc-90 70.55,86.75 Q28.1
N$12
  Top 0.2: Q25.3 Q24.3 58.75,82.3 arc90 59.25,82.8 R11.1 59.25,83.25 arc-90 59.75,83.75 64.2,83.75 arc90 64.7,84.25 Q26.1
N$13
  Top 0.2: Q30.3 Q29.3 81.45,88.7 arc-90 R13.1 82,87.75 arc90 82.5,87.25 92.8,87.25 arc-90 93.3,86.75 Q36.1
N$14
  Top 0.2: 79.25,83.75 82,83.75 | Q32.3 79.25,83.75 | R15.1 82,83.75 | Q33.3 75.5,83.25 arc-90 76,83.75 79.25,83.75 | Q34.1 87.45,84.25 arc-90 86.95,83.75 82,83.75
N$15
  Top 0.2: R10.1 arc-90 61.55,88.7 Q23.3 Q37.3 Q28.3 72.25,88.7 arc-90 73.25,87.7 73.25,86.25 | Q27.1 72.75,84.7 arc90 73.25,85.2 73.25,86.25 | Q30.1 arc-90 74.5,86.25 73.25,86.25
N$16
  Top 0.2: 65.75,82.3 Q27.3 73,82.3 arc90 73.5,82.8 73.5,83.25 arc-90 74,83.75 75,83.75 arc90 75.5,84.25 arc-90 75.95,84.7 Q33.1 | 65.75,82.3 Q26.3 61.5,82.3 arc-90 61,82.8 R12.1 | Q23.1 63.45,86.3 arc-90 63.75,86 arc90 64.25,85.5 65.25,85.5 arc-90 65.75,85 65.75,82.3
N$17
  Top 0.2: SJ17.2 80.5,12.98 arc90 80,12.48 arc-90 79.52,12 77.5,12 arc90 77,11.5 77,10.25 arc-90 76.5,9.75 75.5,9.75 arc-90 75,10.25 75,11.5 arc90 74.5,12 68.55,12 arc90 68.05,11.5 Q2.1
N$25
  Top 0.2: Q74.3 Q73.3 11.7,76.7 arc-90 R33.1 12.25,75.75 arc90 12.75,75.25 23.05,75.25 arc-90 23.55,74.75 Q80.1
N$26
  Top 0.2: Q77.3 Q76.3 11.75,70.3 arc90 12.25,70.8 R35.1 12.25,71.25 arc-90 12.75,71.75 17.2,71.75 arc90 17.7,72.25 Q78.1
N$27
  Top 0.2: Q82.3 Q81.3 34.45,76.7 arc-90 R37.1 35,75.75 arc90 35.5,75.25 45.8,75.25 arc-90 46.3,74.75 Q88.1
N$28
  Top 0.2: Q86.1 40.45,72.25 arc-90 39.95,71.75 35,71.75 | Q85.3 Q84.3 33.05,70.3 arc90 33.5,70.75 arc-90 34.5,71.75 35,71.75 | R39.1 35,71.75
N$29
  Top 0.2: R34.1 arc-90 14.55,76.7 Q75.3 Q89.3 Q80.3 25.25,76.7 arc-90 26.25,75.7 26.25,74.25 | Q79.1 25.75,72.7 arc90 26.25,73.2 26.25,74.25 | Q82.1 arc-90 27.5,74.25 26.25,74.25
N$30
  Top 0.2: 18.75,70.3 Q79.3 26,70.3 arc90 26.5,70.8 26.5,71.25 arc-90 27,71.75 28,71.75 arc90 28.5,72.25 arc-90 28.95,72.7 Q85.1 | 18.75,70.3 Q78.3 14.5,70.3 arc-90 14,70.8 R36.1 | Q75.1 16.45,74.3 arc-90 16.75,74 arc90 17.25,73.5 18.25,73.5 arc-90 18.75,73 18.75,70.3
N$31
  Top 0.2: Q92.3 Q91.3 58.7,76.7 arc-90 R41.1 59.25,75.75 arc90 59.75,75.25 70.05,75.25 arc-90 70.55,74.75 Q98.1
N$32
  Top 0.2: Q95.3 Q94.3 58.75,70.3 arc90 59.25,70.8 R43.1 59.25,71.25 arc-90 59.75,71.75 64.2,71.75 arc90 64.7,72.25 Q96.1
N$33
  Top 0.2: Q100.3 Q99.3 81.45,76.7 arc-90 R45.1 82,75.75 arc90 82.5,75.25 92.8,75.25 arc-90 93.3,74.75 Q106.1
N$34
  Top 0.2: 79.25,71.75 82,71.75 | Q102.3 79.25,71.75 | R47.1 82,71.75 | Q103.3 75.5,71.25 arc-90 76,71.75 79.25,71.75 | Q104.1 87.45,72.25 arc-90 86.95,71.75 82,71.75
N$35
  Top 0.2: R42.1 arc-90 61.55,76.7 Q93.3 Q107.3 Q98.3 72.25,76.7 arc-90 73.25,75.7 73.25,74.25 | Q97.1 72.75,72.7 arc90 73.25,73.2 73.25,74.25 | Q100.1 arc-90 74.5,74.25 73.25,74.25
N$36
  Top 0.2: 65.75,70.3 Q97.3 73,70.3 arc90 73.5,70.8 73.5,71.25 arc-90 74,71.75 75,71.75 arc90 75.5,72.25 arc-90 75.95,72.7 Q103.1 | 65.75,70.3 Q96.3 61.5,70.3 arc-90 61,70.8 R44.1 | Q93.1 63.45,74.3 arc-90 63.75,74 arc90 64.25,73.5 65.25,73.5 arc-90 65.75,73 65.75,70.3
N$49
  Top 0.2: Q146.3 Q145.3 11.7,64.7 arc-90 R65.1 12.25,63.75 arc90 12.75,63.25 23.05,63.25 arc-90 23.55,62.75 Q152.1
N$50
  Top 0.2: Q149.3 Q148.3 11.75,58.3 arc90 12.25,58.8 R67.1 12.25,59.25 arc-90 12.75,59.75 17.2,59.75 arc90 17.7,60.25 Q150.1
N$51
  Top 0.2: Q154.3 Q153.3 34.45,64.7 arc-90 R69.1 35,63.75 arc90 35.5,63.25 45.8,63.25 arc-90 46.3,62.75 Q160.1
N$52
  Top 0.2: Q158.1 40.45,60.25 arc-90 39.95,59.75 35,59.75 | 35,59.75 34.75,59.75 arc90 33.75,58.75 arc-90 33.3,58.3 Q156.3 Q157.3 | R71.1 35,59.75
N$53
  Top 0.2: R66.1 arc-90 14.55,64.7 Q147.3 Q161.3 Q152.3 25.25,64.7 arc-90 26.25,63.7 26.25,62.25 | Q151.1 25.75,60.7 arc90 26.25,61.2 26.25,62.25 | Q154.1 arc-90 27.5,62.25 26.25,62.25
N$54
  Top 0.2: 18.75,58.3 Q151.3 26,58.3 arc90 26.5,58.8 26.5,59.25 arc-90 27,59.75 28,59.75 arc90 28.5,60.25 arc-90 28.95,60.7 Q157.1 | 18.75,58.3 Q150.3 14.5,58.3 arc-90 14,58.8 R68.1 | Q147.1 16.45,62.3 arc-90 16.75,62 arc90 17.25,61.5 18.25,61.5 arc-90 18.75,61 18.75,58.3
N$55
  Top 0.2: Q164.3 Q163.3 58.7,64.7 arc-90 R73.1 59.25,63.75 arc90 59.75,63.25 70.05,63.25 arc-90 70.55,62.75 Q170.1
N$56
  Top 0.2: Q167.3 Q166.3 58.75,58.3 arc90 59.25,58.8 R75.1 59.25,59.25 arc-90 59.75,59.75 64.2,59.75 arc90 64.7,60.25 Q168.1
N$57
  Top 0.2: Q172.3 Q171.3 81.45,64.7 arc-90 R77.1 82,63.75 arc90 82.5,63.25 92.8,63.25 arc-90 93.3,62.75 Q178.1
N$58
  Top 0.2: 79.25,59.75 82,59.75 | Q174.3 79.25,59.75 | R79.1 82,59.75 | Q175.3 75.5,59.25 arc-90 76,59.75 79.25,59.75 | Q176.1 87.45,60.25 arc-90 86.95,59.75 82,59.75
N$59
  Top 0.2: R74.1 arc-90 61.55,64.7 Q165.3 Q179.3 Q170.3 72.25,64.7 arc-90 73.25,63.7 73.25,62.25 | Q169.1 72.75,60.7 arc90 73.25,61.2 73.25,62.25 | Q172.1 arc-90 74.5,62.25 73.25,62.25
N$60
  Top 0.2: 65.75,58.3 Q169.3 73,58.3 arc90 73.5,58.8 73.5,59.25 arc-90 74,59.75 75,59.75 arc90 75.5,60.25 arc-90 75.95,60.7 Q175.1 | 65.75,58.3 Q168.3 61.5,58.3 arc-90 61,58.8 R76.1 | Q165.1 63.45,62.3 arc-90 63.75,62 arc90 64.25,61.5 65.25,61.5 arc-90 65.75,61 65.75,58.3
O0  (via drill 0.7)
  Top 0.2: Q40.3 7.25,46.75 | 7.25,46.75 Q41.3 Q42.3 7.25,37 arc-90 7,36.75 arc90 6.73,36.48 SJ2.3 6.73,33.5 arc90 7.23,33 12.67,33 arc-90 13.17,32.5 JP1.1 | 7.25,46.75 9,46.75 arc-90 10,45.75 R18.1
  Bottom 0.2: v13.16,12.56 JP1.1
O1  (via drill 0.7)
  Top 0.2: Q46.3 15,46.75 | 15,46.75 Q47.3 Q48.3 15,37 arc-90 14.75,36.75 arc90 14.48,36.48 SJ3.3 14.48,33.5 arc90 14.98,33 15.25,33 arc-90 15.71,32.54 JP1.2 | 15,46.75 16.75,46.75 arc-90 17.75,45.75 R20.1
  Bottom 0.2: JP1.2 v15.71,12.55 v15.7,12.56
O2  (via drill 0.7)
  Top 0.2: Q55.3 22.75,46.75 | 22.75,46.75 Q56.3 Q57.3 22.75,37 arc-90 22.5,36.75 arc90 22.23,36.48 SJ4.3 22.23,33.48 arc-90 21.75,33 18.75,33 arc90 18.25,32.5 JP1.3 | 22.75,46.75 24.5,46.75 arc-90 25.5,45.75 R23.1
  Bottom 0.2: v18.24,12.56 JP1.3
O3  (via drill 0.7)
  Top 0.2: Q61.3 30.5,46.75 | 30.5,46.75 Q62.3 Q63.3 30.5,37 arc-90 30.25,36.75 arc90 29.98,36.48 SJ5.3 29.98,33 arc-90 29.48,32.5 21.29,32.5 arc90 20.79,32 JP1.4 | 30.5,46.75 32.25,46.75 arc-90 33.25,45.75 R25.1
  Bottom 0.2: JP1.4 v20.79,12.55 v20.78,12.56
O4  (via drill 0.7)
  Top 0.2: Q67.3 38.25,46.75 | 38.25,46.75 Q68.3 Q69.3 38.25,37 arc-90 38,36.75 arc90 37.73,36.48 SJ6.3 37.73,33.5 arc-90 37.23,33 31.5,33 arc90 31,32.5 arc-90 30.5,32 23.83,32 arc90 23.33,31.5 JP1.5 | 38.25,46.75 40,46.75 arc-90 41,45.75 R27.1
  Bottom 0.2: v23.32,12.56 JP1.5
O5  (via drill 0.7)
  Top 0.2: Q109.3 46,46.75 | 46,46.75 Q110.3 Q111.3 46,37 arc-90 45.75,36.75 arc90 45.48,36.48 45.48,34.75 SJ7.3 45.48,33 arc-90 44.98,32.5 32.25,32.5 arc90 31.75,32 arc-90 31.25,31.5 26.37,31.5 arc90 25.87,31 JP1.6 | 46,46.75 47.75,46.75 arc-90 48.75,45.75 R29.1
  Bottom 0.2: v25.86,12.56 JP1.6
O6  (via drill 0.7)
  Top 0.2: Q115.3 53.75,46.75 | 53.75,46.75 Q116.3 Q117.3 53.75,37 arc-90 53.5,36.75 arc90 53.23,36.48 SJ8.3 arc-90 53.25,34.48 53.25,32.5 arc-90 52.75,32 32.75,32 arc90 32.25,31.5 arc-90 31.75,31 28.91,31 arc90 28.41,30.5 JP1.7 | 53.75,46.75 55.5,46.75 arc-90 56.5,45.75 R31.1
  Bottom 0.2: v28.4,12.56 JP1.7
O7  (via drill 0.7)
  Top 0.2: Q121.3 61.5,46.75 | 61.5,46.75 Q122.3 Q123.3 61.5,37 arc-90 61.25,36.75 arc90 60.98,36.48 SJ9.3 60.98,33.25 arc-90 60.48,32.75 54.5,32.75 arc90 54,32.25 54,32 arc-90 53.5,31.5 33.5,31.5 arc90 33,31 arc-90 32.5,30.5 31.45,30.5 arc90 30.95,30 JP1.8 | 61.5,46.75 63.25,46.75 arc-90 64.25,45.75 R49.1
  Bottom 0.2: v30.94,12.56 JP1.8
O8  (via drill 0.7)
  Top 0.2: Q127.3 69.25,46.75 | 69.25,46.75 Q128.3 Q129.3 69.25,37 arc-90 69,36.75 arc90 68.73,36.48 68.73,34.75 SJ10.3 68.73,32.75 arc-90 68.23,32.25 55.25,32.25 arc90 54.75,31.75 54.75,31.5 arc-90 54.25,31 33.99,31 arc90 33.49,30.5 JP1.9 | 69.25,46.75 71,46.75 arc-90 72,45.75 R51.1
  Bottom 0.2: v33.48,12.56 JP1.9
O9  (via drill 0.7)
  Top 0.2: Q133.3 77,46.75 | 77,46.75 Q134.3 Q135.3 77,37 arc-90 76.75,36.75 arc90 76.48,36.48 SJ11.3 76.48,32.25 arc-90 75.98,31.75 56,31.75 arc90 55.5,31.25 55.5,31 arc-90 55,30.5 36.53,30.5 arc90 36.03,30 JP1.10 | 77,46.75 78.75,46.75 arc-90 79.75,45.75 R53.1
  Bottom 0.2: v36.02,12.56 JP1.10
O10  (via drill 0.7)
  Top 0.2: Q139.3 84.75,46.75 | 84.75,46.75 Q140.3 Q141.3 84.75,37 arc-90 84.5,36.75 arc90 84.23,36.48 SJ12.3 84.23,31.75 arc-90 83.73,31.25 56.75,31.25 arc90 56.25,30.75 56.25,30.5 arc-90 55.75,30 39.07,30 arc90 38.57,29.5 JP1.11 | 84.75,46.75 86.5,46.75 arc-90 87.5,45.75 R55.1
  Bottom 0.2: v38.56,12.56 JP1.11
O11  (via drill 0.7)
  Top 0.2: Q181.3 92.5,46.75 | 92.5,46.75 Q182.3 Q183.3 92.5,37 arc-90 92.25,36.75 arc90 91.98,36.48 SJ1.3 91.98,31.25 arc-90 91.48,30.75 57.5,30.75 arc90 57,30.25 57,30 arc-90 56.5,29.5 41.86,29.5 arc90 41.11,28.75 JP1.12 | 92.5,46.75 94.25,46.75 arc-90 95.25,45.75 R57.1
  Bottom 0.2: v41.1,12.56 JP1.12
Q0  (via drill 0.3, 0.35)
  Top 0.2: 39.45,88.75 Q13.3 39.5,89.5 | 36.75,88.25 R6.1 36.75,89.5 | Q17.1 48.5,84.7 arc90 49,85.2 49,86.25 | 49,86.25 49,88.75 arc90 48.25,89.5 47.25,89.5 | Q22.1 arc-90 51.75,86.25 49,86.25 | 47.25,89.5 43.25,89.5 | 43.25,89.5 39.5,89.5 | 39.5,89.5 36.75,89.5 | 36.75,89.5 3.75,89.5 arc90 3,88.5 v3,87.25 | Q20.3 43.25,89.5 | Q18.3 47.25,89.5 | v2,55.5 2.61,55.5 2.74,55.63 4.33,55.63 4.45,55.5 13.39,55.5 13.5,55.6 14,55.6 14.11,55.5 52.4,55.5 52.5,55.6 53,55.6 53.1,55.5 v60.25,55.5 | Q121.1 60.55,48.95 arc90 v60.25,49.25 | Q40.1 6.3,49.45 arc90 v6,49.75
  Bottom 0.2: v3,87.25 arc90 2,86.25 v2,55.5 2,50.25 arc90 2.5,49.75 v6,49.75 | v60.25,49.25 v60.25,55.5
Q1  (via drill 0.3, 0.35)
  Top 0.2: R14.1 83.75,88.25 arc-90 84.25,88.75 86.45,88.75 Q31.3 Q38.3 Q36.3 95.5,88.7 arc-90 96,88.2 96,84.5 | Q74.1 arc-90 4.75,74.25 4,74.25 | 4,74.25 arc-90 3,75.25 3,79 arc-90 4,80 95,80 arc90 96,81 96,84.5 | Q35.1 95.8,84.7 arc-90 96,84.5 | 4,74.25 4,72.5 arc-90 v3.75,72.25 | v4,54.5 4.61,54.5 4.74,54.63 5.26,54.63 5.32,54.57 6.38,54.57 6.46,54.49 v12.75,54.49 13.4,54.49 13.5,54.4 14,54.4 14.1,54.49 21.25,54.49 21.25,54.5 21.75,54.5 21.75,54.49 28.83,54.49 28.83,54.5 52.4,54.5 52.5,54.4 58.65,54.4 58.75,54.5 59.25,54.5 59.26,54.49 60.67,54.49 60.67,54.5 v68,54.5 | v68,49.25 68,49.23 arc-90 68.3,48.93 Q127.1 | Q47.1 13.25,41.55 arc-90 12.75,42.05 v12.75,49.75
  Bottom 0.2: v3.75,72.25 4,72 v4,54.5 | v68,49.25 v68,54.5 | v12.75,49.75 v12.75,54.49
Q2  (via drill 0.3, 0.35)
  Top 0.2: R38.1 36.75,76.25 arc-90 37.25,76.75 39.45,76.75 Q83.3 Q90.3 Q88.3 48.5,76.7 arc-90 49,76.2 49,74.25 | Q92.1 arc-90 51.75,74.25 49,74.25 | 49,74.25 49,72.75 | 49,72.75 v49,71 | v49,67.25 8,67.25 arc90 7,66.25 v7,66 | Q87.1 arc-90 48.25,72.75 49,72.75 | v76.25,52.89 75.7,52.89 75.5,53.09 75,53.09 74.8,52.89 58.58,52.89 58.47,53 37.35,53 37.25,53.1 36.75,53.1 36.65,53 29.61,53 29.5,52.89 21.08,52.89 20.97,53 v20.25,53 v7,53 | Q56.1 20.75,41.55 arc-90 20.25,42.05 v20.25,49.75 | Q133.1 76.05,49.05 arc-90 v76.25,49.25
  Bottom 0.2: v49,71 v49,67.25 | v7,66 v7,53 | v76.25,49.25 v76.25,52.89 | v20.25,49.75 v20.25,53
Q3  (via drill 0.3, 0.35)
  Top 0.2: R46.1 83.75,76.25 arc-90 84.25,76.75 86.45,76.75 Q101.3 Q108.3 Q106.3 95.5,76.7 arc-90 96,76.2 96,72.75 | Q146.1 arc-90 4.75,62.25 4,62.25 arc-90 3,63.25 3,67 arc-90 4,68 95.5,68 | Q105.1 95.95,72.7 arc90 96,72.75 | 95.5,68 arc-90 96.5,67 | 95.5,68 arc-90 96.5,67 | 95.5,68 arc90 96,68.5 96,72.75 | v96,57 arc90 96.5,57.5 96.5,67 | v28,52.1 28.65,52.1 28.67,52.09 29.83,52.09 29.85,52.1 36.25,52.1 36.33,52.03 36.62,52.03 36.75,51.9 37.25,51.9 37.38,52.03 49.64,52.03 49.74,52.13 50.26,52.13 50.39,52 74.89,52 75,51.89 76.67,51.89 76.78,52.01 83.42,52.01 83.42,52 v84,52 95.75,52 arc-90 v96,51.75 | Q62.1 28.5,41.55 arc-90 28,42.05 v28,49.75 | Q139.1 83.8,49.05 arc-90 v84,49.25
  Bottom 0.2: v84,49.25 v84,52 | v28,49.75 v28,52.1 | v96,51.75 v96,57
Q4  (via drill 0.3, 0.35)
  Top 0.2: R70.1 36.75,64.25 arc-90 37.25,64.75 39.45,64.75 Q155.3 Q162.3 Q160.3 48.5,64.7 arc-90 49,64.2 49,62.25 | Q159.1 48.5,60.7 arc90 49,61.2 49,62.25 | Q164.1 arc-90 51.75,62.25 50,62.25 | 50,62.25 49,62.25 | 50,62.25 v50,59.25 | v36,51.5 36.58,51.5 36.58,51.49 43.32,51.49 43.33,51.51 44.17,51.51 44.17,51.5 44.4,51.5 44.5,51.6 45,51.6 45.1,51.5 48.61,51.5 48.74,51.63 49.26,51.63 49.39,51.5 v50,51.5 50.03,51.53 74.79,51.53 74.83,51.49 76.83,51.49 76.95,51.6 83.25,51.6 83.33,51.53 83.62,51.53 83.75,51.4 84.25,51.4 84.38,51.53 91.05,51.53 arc-90 91.55,51.03 Q181.1 | Q68.1 36.5,41.55 arc-90 36,42.05 v36,49.75
  Bottom 0.2: v50,59.25 v50,51.5 | v36,49.75 v36,51.5
Q5  (via drill 0.35)
  Top 0.2: R78.1 83.75,64.25 arc-90 84.25,64.75 86.45,64.75 Q173.3 Q180.3 Q178.3 95.5,64.7 arc-90 96,64.2 96,60.75 | 95.5,60.7 Q177.1 95.95,60.7 arc90 96,60.75 | 6.7,84.5 Q7.1 6.7,84 arc-90 6.2,83.5 3,83.5 arc90 2,82.5 2,58.5 arc90 3,57.5 52,57.5 | 52,57.5 95,57.5 arc90 96,58.5 96,60.75 | 52,57.5 51.75,57.75 v51.75,58 | v52,50.5 51.39,50.5 51.26,50.63 50.74,50.63 50.48,50.37 48.74,50.37 48.61,50.5 45.1,50.5 45,50.4 44.5,50.4 44.4,50.5 43.25,50.5 | 43.25,50.5 36.42,50.5 36.42,50.49 35.58,50.49 35.58,50.5 5,50.5 arc90 4.5,50 4.5,42.05 arc90 5,41.55 Q41.1 | Q110.1 43.75,41.55 arc-90 43.25,42.05 43.25,50.5
  Bottom 0.2: v51.75,58 52,57.75 v52,50.5
VCC  (via drill 0.3, 0.35)
  Top 0.2: 14,85.5 v13.12,85.5 12.25,85.5 | 14,85.5 R4.2 | 14,85.5 R2.2 | 12.25,85.5 R3.2 | 12.25,85.5 R1.2 | 36.75,85.5 v35.88,85.5 35,85.5 | 36.75,85.5 R8.2 | 36.75,85.5 R6.2 | 35,85.5 R7.2 | 35,85.5 R5.2 | 61,85.5 v60.12,85.5 59.25,85.5 | 61,85.5 R12.2 | 61,85.5 R10.2 | 59.25,85.5 R11.2 | 59.25,85.5 R9.2 | 83.75,85.5 v82.88,85.5 82,85.5 | 83.75,85.5 R16.2 | 83.75,85.5 R14.2 | 82,85.5 R15.2 | 82,85.5 R13.2 | 14,73.5 v13.12,73.5 12.25,73.5 | 14,73.5 R36.2 | 14,73.5 R34.2 | 12.25,73.5 R35.2 | 12.25,73.5 R33.2 | 36.75,73.5 v35.88,73.5 35,73.5 | 36.75,73.5 R40.2 | 36.75,73.5 R38.2 | 35,73.5 R39.2 | 35,73.5 R37.2 | 61,73.5 v60.12,73.5 59.25,73.5 | 61,73.5 R44.2 | 61,73.5 R42.2 | 59.25,73.5 R43.2 | 59.25,73.5 R41.2 | 83.75,73.5 v82.88,73.5 82,73.5 | 83.75,73.5 R48.2 | 83.75,73.5 R46.2 | 82,73.5 R47.2 | 82,73.5 R45.2 | 14,61.5 v13.12,61.5 12.25,61.5 | 14,61.5 R68.2 | 14,61.5 R66.2 | 12.25,61.5 R67.2 | 12.25,61.5 R65.2 | 36.75,61.5 v35.88,61.5 35,61.5 | 36.75,61.5 R72.2 | 36.75,61.5 R70.2 | 35,61.5 R71.2 | 35,61.5 R69.2 | 61,61.5 v60.12,61.5 59.25,61.5 | 61,61.5 R76.2 | 61,61.5 R74.2 | 59.25,61.5 R75.2 | 59.25,61.5 R73.2 | 83.75,61.5 v82.88,61.5 82,61.5 | 83.75,61.5 R80.2 | 83.75,61.5 R78.2 | 82,61.5 R79.2 | 82,61.5 R77.2 | v10.75,39 10.25,39 arc-90 10,39.25 R18.2 | v18.5,39 18,39 arc-90 17.75,39.25 R20.2 | v26.25,39 25.75,39 arc-90 25.5,39.25 R23.2 | v34,39 33.5,39 arc-90 33.25,39.25 R25.2 | v41.75,39 41.25,39 arc-90 41,39.25 R27.2 | v49.5,39 49,39 arc-90 48.75,39.25 R29.2 | v57.25,39 56.75,39 arc-90 56.5,39.25 R31.2 | v65,39 64.5,39 arc-90 64.25,39.25 R49.2 | v72.75,39 72.25,39 arc-90 72,39.25 R51.2 | v80.5,39 80,39 arc-90 79.75,39.25 R53.2 | v88.25,39 87.75,39 arc-90 87.5,39.25 R55.2 | v96,39 95.5,39 arc-90 95.25,39.25 R57.2
  Top 0.2: R17.2 45,18.5 | R21.2 77,19.5 | R19.2 73,19.5 | 89,15 C1.1
  Top 0.4: 99,39 99,22.25 99,20.5 arc-90 98,19.5 97.25,19.5 91,19.5 | 99,39 99,61.5 | 99,61.5 99,73.5 | 99,73.5 99,85.5 v98,85.5 | v98,73.5 99,73.5 | v98,61.5 99,61.5 | JP1.29 84.29,3 arc90 85.29,2 89,2 90,2 arc90 91,3 91,15.25 | 45,18.5 arc-90 46,19.5 73,19.5 77,19.5 91,19.5 | 91,15.25 89.25,15.25 arc90 89,15 | 91,15.25 91,19.5 | v98,39 99,39
  Bottom 0.2: v13.12,85.5 v35.88,85.5 40,85.5 arc90 40.5,86 40.5,86.5 arc-90 41,87 41.5,87 arc-90 42,86.5 42,86 arc90 42.5,85.5 58,85.5 arc90 58.5,86 58.5,86.5 arc-90 59,87 65.75,87 arc-90 66.25,86.5 66.25,85.5 | v60.12,85.5 66.25,85.5 | 66.25,85.5 v82.88,85.5 87,85.5 arc90 87.5,86 87.5,86.5 arc-90 88,87 88.5,87 arc-90 89,86.5 89,86 arc90 89.5,85.5 v98,85.5 | v13.12,73.5 v35.88,73.5 40,73.5 arc90 40.5,74 40.5,74.5 arc-90 41,75 41.5,75 arc-90 42,74.5 42,74 arc90 42.5,73.5 58,73.5 arc90 58.5,74 58.5,74.5 arc-90 59,75 65.75,75 arc-90 66.25,74.5 66.25,73.5 | v60.12,73.5 66.25,73.5 | 66.25,73.5 v82.88,73.5 87,73.5 arc90 87.5,74 87.5,74.5 arc-90 88,75 88.5,75 arc-90 89,74.5 89,74 arc90 89.5,73.5 v98,73.5 | v13.12,61.5 v35.88,61.5 40,61.5 arc90 40.5,62 40.5,62.5 arc-90 41,63 41.5,63 arc-90 42,62.5 42,62 arc90 42.5,61.5 58,61.5 arc90 58.5,62 58.5,62.5 arc-90 59,63 65.75,63 arc-90 66.25,62.5 66.25,61.5 | v60.12,61.5 66.25,61.5 | 66.25,61.5 v82.88,61.5 87,61.5 arc90 87.5,62 87.5,62.5 arc-90 88,63 88.5,63 arc-90 89,62.5 89,62 arc90 89.5,61.5 v98,61.5
  Bottom 0.4: v10.75,39 v18.5,39 v26.25,39 v34,39 v41.75,39 v49.5,39 v57.25,39 v65,39 v72.75,39 v80.5,39 v88.25,39 v96,39 | v96,39 95.04,39 | v96,39 v98,39

## Text on the board
tPlace: CLK | 0 | 1 | 2 | 3 | 4 | 5 | 6 | 7 | 8 | 9 | 10 | 11
bPlace: SmallRoomLabs | Johnson / counter / rev1 | Out0 | Out1 | Out2 | Out3 | Out4 | Out5 | Out6 | Out7 | Out8 | Out9 | Out10 | Out11 | Clock | Clear
Reference: 148T 63R 1C